# Altium schematic sheet 电子脚铐手表主控板.SchDoc
size A4
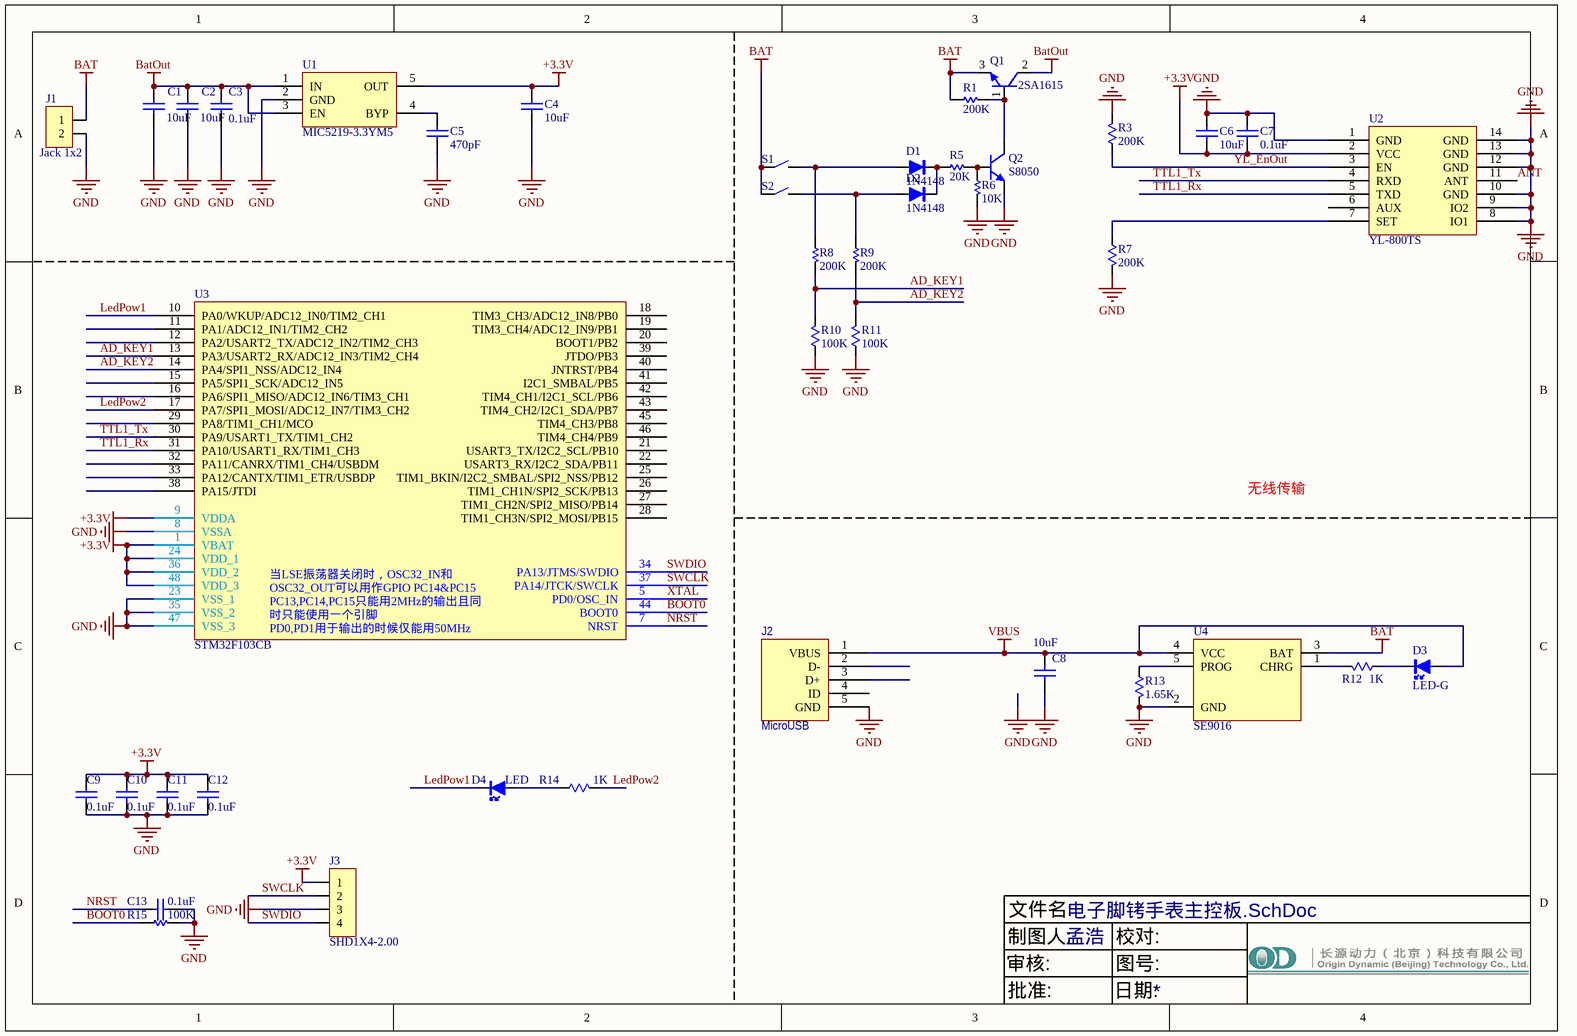
[diagram p0: 电子脚铐手表主控板.SchDoc]

## Parts
C1  10uF  [C0603]
C2  10uF  [C0603]
C3  0.1uF  [C0603]
C4  10uF  [C0603]
C5  470pF  [C0603]
C6  10uF  [C0603]
C7  0.1uF  [C0603]
C8  10uF  [C0603]
C9  0.1uF  [C0603]
C10  0.1uF  [C0603]
C11  0.1uF  [C0603]
C12  0.1uF  [C0603]
C13  0.1uF  [C0603]
D1  1N4148  [SOD-80-S]
D2  1N4148  [SOD-80-S]
D3  LED-G  [LED0603]
D4  LED  [Led1206]
J1  Jack 1x2  [Jk1*2-2.0]
J2  MicroUSB  [MICRO-USB]
J3  SHD1X4-2.00  [Jk1*4-2.0]
Q1  2SA1615  [TO-252]
Q2  S8050  [SOT-23]
R1  200K  [R0603]
R3  200K  [R0603]
R5  20K  [R0603]
R6  10K  [R0603]
R7  200K  [R0603]
R8  200K  [R0603]
R9  200K  [R0603]
R10  100K  [R0603]
R11  100K  [R0603]
R12  1K  [R0603]
R13  1.65K  [R0603]
R14  1K  [R0603]
R15  100K  [R0603]
S1  Switch  [TS-1110U]  (value not drawn)
S2  Switch  [SIDE_BUTTON]  (value not drawn)
U1  MIC5219-3.3YM5  [SOT-23-5]
U2  YL-800TS  [YL-800TS]
U3  STM32F103CB  [LQFP48]
U4  SE9016  [SOT-23-5]

## Nets
+3.3V: C4.1 C6.1 C7.1 C9.1 C10.1 C11.1 C12.1 J3.1 U1.5(OUT) U2.2(VCC) U3.1(VBAT) U3.9(VDDA) U3.24(VDD_1) U3.36(VDD_2) U3.48(VDD_3)
BAT: J1.1 Q1.3(E) R1.1 S1.1 S2.1 U4.3(BAT)
BatOut: C1.1 C2.1 C3.2 Q1.2(C) U1.1(IN) U1.3(EN)
GND: C1.2 C2.2 C3.1 C4.2 C5.2 C6.2 C7.2 C8.2 C9.2 C10.2 C11.2 C12.2 C13.2 J1.2 J2.5(GND) J3.3 Q2.2(e) R3.2 R6.2 R7.2 R10.1 R11.1 R13.1 R15.2 U1.2(GND) U2.1(GND) U2.8(IO1) U2.9(IO2) U2.10(GND) U2.12(GND) U2.13(GND) U2.14(GND) U3.8(VSSA) U3.23(VSS_1) U3.35(VSS_2) U3.47(VSS_3) U4.2(GND)
VBUS: C8.1 D3.1(A) J2.1(VBUS) U4.4(VCC)
AD_KEY1: R8.2 R10.2 U3.13(PA3/USART2_RX/ADC12_IN3/TIM2_CH4)
AD_KEY2: R9.2 R11.2 U3.14(PA4/SPI1_NSS/ADC12_IN4)
ANT: U2.11(ANT)
BOOT0: R15.1 U3.44(BOOT0)
LedPow1: D4.2(K) U3.10(PA0/WKUP/ADC12_IN0/TIM2_CH1)
LedPow2: R14.1 U3.17(PA7/SPI1_MOSI/ADC12_IN7/TIM3_CH2)
NRST: C13.1 U3.7(NRST)
SWCLK: J3.2 U3.37(PA14/JTCK/SWCLK)
SWDIO: J3.4 U3.34(PA13/JTMS/SWDIO)
TTL1_Rx: U2.5(TXD) U3.31(PA10/USART1_RX/TIM1_CH3)
TTL1_Tx: U2.4(RXD) U3.30(PA9/USART1_TX/TIM1_CH2)
XTAL: U3.5(PD0/OSC_IN)
YL_EnOut: R3.1 U2.3(EN)
NetC5_1: C5.1 U1.4(BYP)
NetD1_1: D1.1(A) R8.1 S1.2
NetD1_2: D1.2(K) D2.2(K) R5.1
NetD2_1: D2.1(A) R9.1 S2.2
NetD3_2: D3.2(K) R12.2
NetD4_1: D4.1(A) R14.2
NetQ1_1: Q1.1(B) Q2.3(c) R1.2
NetQ2_1: Q2.1(b) R5.2 R6.1
NetR7_1: R7.1 U2.7(SET)
NetR12_1: R12.1 U4.1(CHRG)
NetR13_2: R13.2 U4.5(PROG)

Not connected (* = marked no-connect by the designer): J2 2(D-) 3(D+) 4(ID); U2 6(AUX); U3 2(PC13-TAMPER-RTC) 3(PC14-OSC32_IN) 4(PC15-OSC32_OUT) 6(PD1/OSC_OUT) 11(PA1/ADC12_IN1/TIM2_CH2) 12(PA2/USART2_TX/ADC12_IN2/TIM2_CH3) 15(PA5/SPI1_SCK/ADC12_IN5) 16(PA6/SPI1_MISO/ADC12_IN6/TIM3_CH1) 18(TIM3_CH3/ADC12_IN8/PB0) 19(TIM3_CH4/ADC12_IN9/PB1) 20(BOOT1/PB2) 21(USART3_TX/I2C2_SCL/PB10) 22(USART3_RX/I2C2_SDA/PB11) 25(TIM1_BKIN/I2C2_SMBAL/SPI2_NSS/PB12) 26(TIM1_CH1N/SPI2_SCK/PB13) 27(TIM1_CH2N/SPI2_MISO/PB14) 28(TIM1_CH3N/SPI2_MOSI/PB15) 29(PA8/TIM1_CH1/MCO) 32(PA11/CANRX/TIM1_CH4/USBDM) 33(PA12/CANTX/TIM1_ETR/USBDP) 38(PA15/JTDI) 39(JTDO/PB3) 40(JNTRST/PB4) 41(I2C1_SMBAL/PB5) 42(TIM4_CH1/I2C1_SCL/PB6) 43(TIM4_CH2/I2C1_SDA/PB7) 45(TIM4_CH3/PB8) 46(TIM4_CH4/PB9)

## Notes on the sheet
- 无线传输
- 文件名:
- 审核:
- 制图人:
- 孟浩
- 校对:
- 图号:
- 批准:
- 日期:
- (in symbol STM32F103Cx) OSC32_IN和OSC32_OUT可以用作通用IO PC14和PC15; PC13,PC14,PC15只能用于2MHz的输出模式且同时只能使用一个引脚; 当LSE振荡器关闭时，OSC32_IN和OSC32_OUT可以用作GPIO PC14&PC15 / PC13,PC14,PC15只能用2MHz的输出且同时只能使用一个引脚 / PD0,PD1用于输出的时候仅能用50MHz

## Library data of the parts
C1 C2 C4-C7 = CAP: Published: 8-Jun-2000; LatestRevisionDate: 17-Jul-2002; LatestRevisionNote: Re-released for DXP Platform.; PackageReference: RAD-0.3; Publisher: Altium Limited
  C1 C2 C4 C6: Value: 10uF
  C5: Value: 470pF
  C7: Value: 0.1uF
C3 C9-C13 = Cap Semi
C8 = Cap: Capacitor; Published: 8-Jun-2000; LatestRevisionDate: 17-Jul-2002; LatestRevisionNote: Re-released for DXP Platform.; PackageReference: RAD-0.3; Publisher: Altium Limited; PackageDescription: Radial Cap, Thru-Hole; 2 Leads; 0.3 in Pin Spacing
D1 D2 = DIODE-SWITCHING: Silicon Epitaxial Planar Diodes
D3 = LED
J1 = Jack 1x2: 插座
J3 = HEADER1X4
Q1 = MJD122
Q2 = S8050: NPN triode, 0.5A Max
R1 R5 R6 R8 R9 R15 = Res
R3 R7 R10 R11 = RES: Resistor; Published: 8-Jun-2000; LatestRevisionDate: 17-Jul-2002; LatestRevisionNote: Re-released for DXP Platform.; PackageReference: AXIAL-0.3; Publisher: Altium Limited
  R3 R7: Value: 200K
  R10 R11: Value: 100K
R12-R14 = Res: Resistor; Published: 8-Jun-2000; LatestRevisionDate: 04-Mar-2005; LatestRevisionNote: PCB Footprint replaced.; PackageReference: J1-0603; Publisher: Altium Limited
  R12 R14: Value: 1K
  R13: Value: 1.65K
S1 S2 = Sw
U1 = MIC5205
U3 = STM32F103Cx